# Altium schematic sheet [9]-MODEM_POWER.SchDoc
size A4
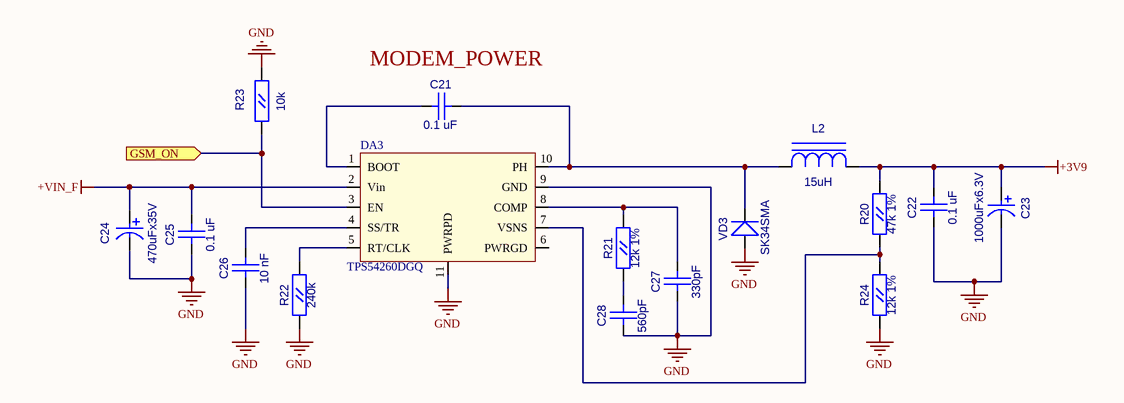
[diagram p0: [9]-MODEM_POWER.SchDoc]

## Parts
C21  0.1 uF  [CC0603]
C22  0.1 uF  [CC0603]
C23  1000uFx6.3V  [CAP_8x14_R]
C24  470uFx35V  [CC16X10_CAP0.5(1)(Primary)]
C25  0.1 uF  [CC0603]
C26  10 nF  [CC0603]
C27  330pF  [CC0603]
C28  560pF  [CC0603]
DA3  TPS54260DGQ  [S-PDSO-G10]
L2  15uH  [SDR0805]
R20  47k 1%  [RC0603]
R21  12k 1%  [RC0603]
R22  240k  [RC0603]
R23  10k  [RC0603]
R24  12k 1%  [RC0603]
VD3  SK34SMA  [SMA]

## Ports
GSM_ON (in)

## Nets
+3V9: C22.1(A) C23.1 L2.2(A) R20.2(B)
+VIN_F: C24.2 C25.1(A) DA3.2(Vin)
GND: C22.2(B) C23.2 C24.1 C25.2(B) C26.2(B) C27.2(B) C28.2(B) DA3.9(GND) DA3.11(PWRPD) R22.1(A) R23.2(B) R24.1(A) VD3.1(A)
GSM_ON: DA3.3(EN) R23.1(A) ; port GSM_ON
NetC21_1: C21.1(A) DA3.10(PH) L2.1(C) VD3.2(K)
NetC21_2: C21.2(B) DA3.1(BOOT)
NetC26_1: C26.1(A) DA3.4(SS/TR)
NetC27_1: C27.1(A) DA3.8(COMP) R21.2(B)
NetC28_1: C28.1(A) R21.1(A)
NetDA3_5: DA3.5(RT/CLK) R22.2(B)
NetDA3_7: DA3.7(VSNS) R20.1(A) R24.2(B)

Not connected (* = marked no-connect by the designer): DA3 6(PWRGD)

## Notes on the sheet
- (near C21) MODEM_POWER

## Library data of the parts
C21 C22 C25-C28 = CC0603
  C21 C22 C25: Value: 0.1 uF
  C26: Value: 10 nF
  C27: Value: 330pF
  C28: Value: 560pF
C23 = CAP_8mm: Radial capacitor; Value: 1000uFx6.3V
C24 = CAP0.5(1): Value: 470uFx35V
L2 = SDR0805: Value: 15uH
R20-R24 = RC0603
  R20: Value: 47k 1%
  R21 R24: Value: 12k 1%
  R22: Value: 240k
  R23: Value: 10k
VD3 = SK34SMA: Schottky Rectifier; Value: {Value}